# EasyEDA Pro project uven2-mk3-cc-driver-80x.eprj, schematic Schematic1
Board Name: Board1; Create Date: 2025-05-28; Page Name: P1; Project Name: uven2-mk3-cc-driver-80x; Schematic Name: Schematic1; Update Date: 2025-05-28; Company: EasyEDA.com; Page Size: A4; Version: V1.0
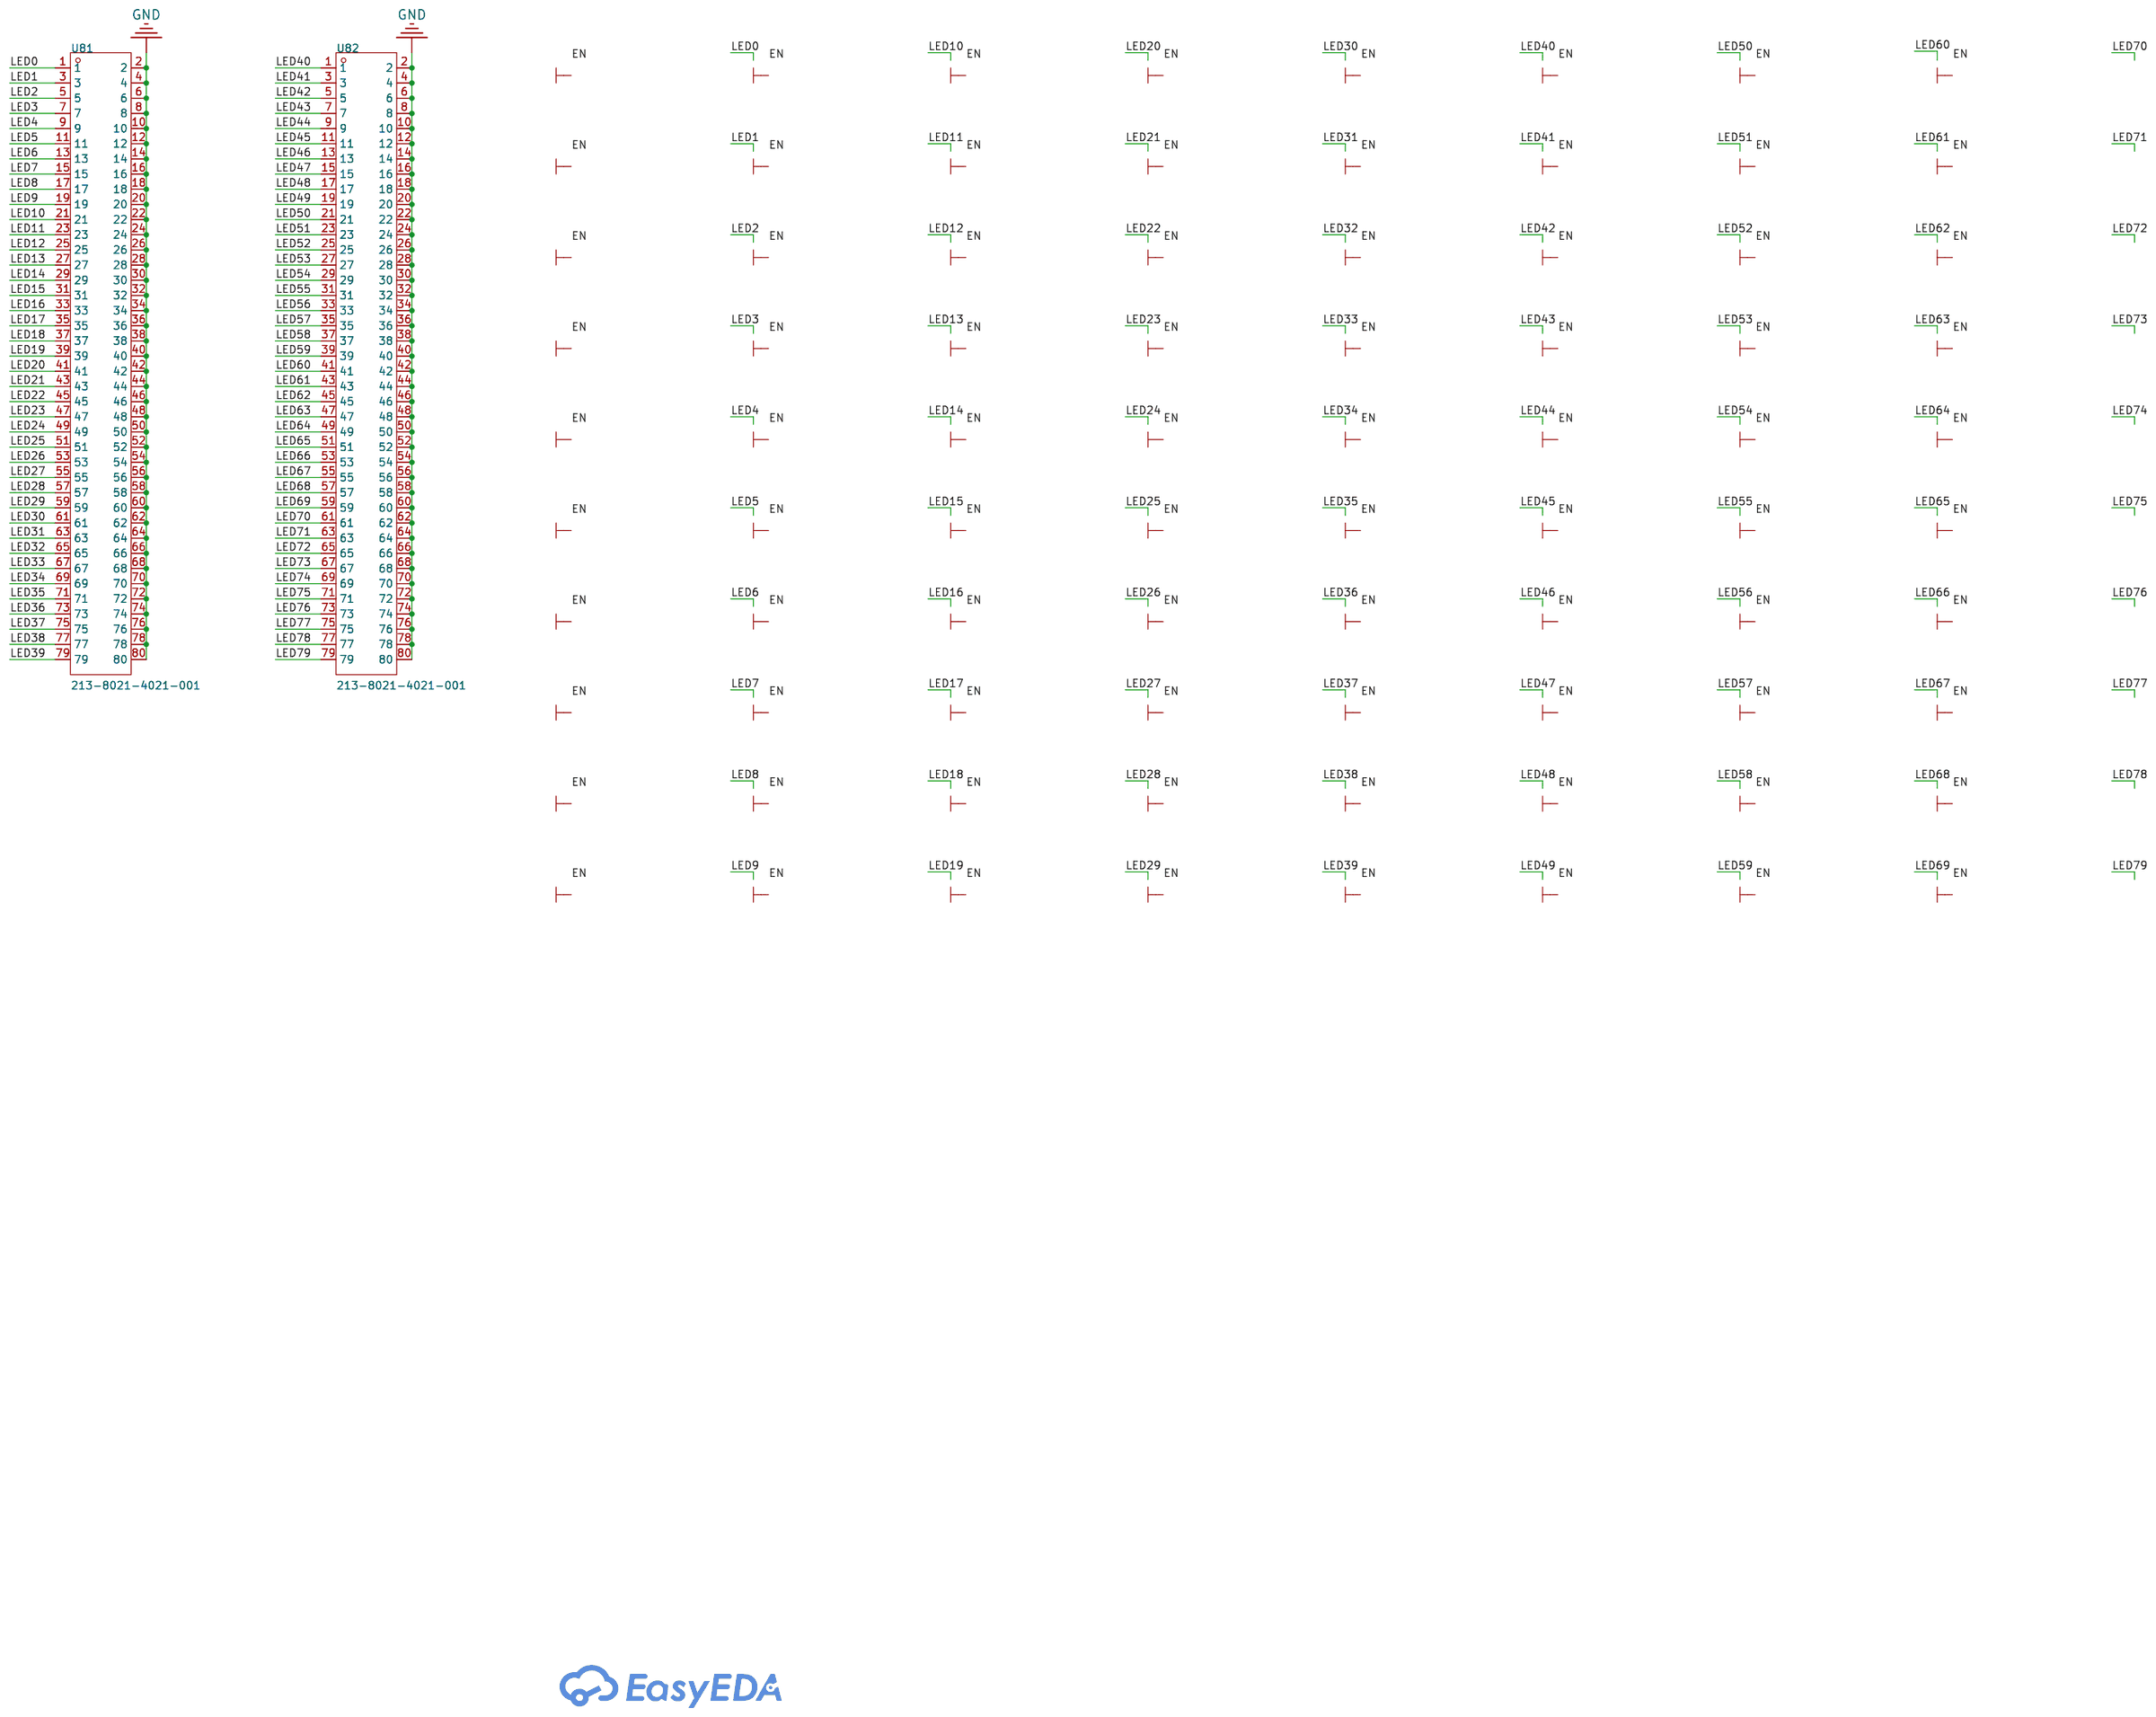
[diagram p0: schematic sheet]

## Parts
CBB1  -
CBB2  -
CBB3  -
CBB4  -
CBB5  -
CBB6  -
CBB7  -
CBB8  -
CBB9  -
CBB10  -
CBB11  -
CBB12  -
CBB13  -
CBB14  -
CBB15  -
CBB16  -
CBB17  -
CBB18  -
CBB19  -
CBB20  -
CBB21  -
CBB22  -
CBB23  -
CBB24  -
CBB25  -
CBB26  -
CBB27  -
CBB28  -
CBB29  -
CBB30  -
CBB31  -
CBB32  -
CBB33  -
CBB34  -
CBB35  -
CBB36  -
CBB37  -
CBB38  -
CBB39  -
CBB40  -
CBB41  -
CBB42  -
CBB43  -
CBB44  -
CBB45  -
CBB46  -
CBB47  -
CBB48  -
CBB49  -
CBB50  -
CBB51  -
CBB52  -
CBB53  -
CBB54  -
CBB55  -
CBB56  -
CBB57  -
CBB58  -
CBB59  -
CBB60  -
CBB61  -
CBB62  -
CBB63  -
CBB64  -
CBB65  -
CBB66  -
CBB67  -
CBB68  -
CBB69  -
CBB70  -
CBB71  -
CBB72  -
CBB73  -
CBB74  -
CBB75  -
CBB76  -
CBB77  -
CBB78  -
CBB79  -
CBB80  -
U81  213-8021-4021-001  [HDR-TH_80P-P2.54-H-M-R2-C40-S2.54-W13.5-N]
U82  213-8021-4021-001  [HDR-TH_80P-P2.54-H-M-R2-C40-S2.54-W13.5-N]

## Library data of the parts
U81 U82 = 213-8021-4021-001: LCSC Part Name: 2x40P 间距:2.54mm 方针 弯插; Supplier Part: C2846095; Manufacturer: Nextron(正凌); Supplier Footprint: 弯插,P=2.54mm; JLCPCB Part Class: Extended Part; Datasheet: https://atta.szlcsc.com/upload/public/pdf/source/20241106/B3AA44D43FCA82CBDD5EE1450DF726D5.pdf; Supplier: LCSC; Pin Structure: 2x40P; Pitch: 2.54mm; Row Spacing: 2.54mm; Circluar Pins/Square Pins: Policy; Mounting Type: Right-Angle; Number of Rows: Double Row; Number of Pins: 80P; Current Rating: 3A; Voltage Rating (Max): 250V; Insulation Height: 2.5mm; Operating Temperature: -25℃~+105℃; Color: Black

## Nets
+12V: CBB1.(ANODE) CBB2.(ANODE) CBB3.(ANODE) CBB4.(ANODE) CBB5.(ANODE) CBB6.(ANODE) CBB7.(ANODE) CBB8.(ANODE) CBB9.(ANODE) CBB10.(ANODE) CBB11.(ANODE) CBB12.(ANODE) CBB13.(ANODE) CBB14.(ANODE) CBB15.(ANODE) CBB16.(ANODE) CBB17.(ANODE) CBB18.(ANODE) CBB19.(ANODE) CBB20.(ANODE) CBB21.(ANODE) CBB22.(ANODE) CBB23.(ANODE) CBB24.(ANODE) CBB25.(ANODE) CBB26.(ANODE) CBB27.(ANODE) CBB28.(ANODE) CBB29.(ANODE) CBB30.(ANODE) CBB31.(ANODE) CBB32.(ANODE) CBB33.(ANODE) CBB34.(ANODE) CBB35.(ANODE) CBB36.(ANODE) CBB37.(ANODE) CBB38.(ANODE) CBB39.(ANODE) CBB40.(ANODE) CBB41.(ANODE) CBB42.(ANODE) CBB43.(ANODE) CBB44.(ANODE) CBB45.(ANODE) CBB46.(ANODE) CBB47.(ANODE) CBB48.(ANODE) CBB49.(ANODE) CBB50.(ANODE) CBB51.(ANODE) CBB52.(ANODE) CBB53.(ANODE) CBB54.(ANODE) CBB55.(ANODE) CBB56.(ANODE) CBB57.(ANODE) CBB58.(ANODE) CBB59.(ANODE) CBB60.(ANODE) CBB61.(ANODE) CBB62.(ANODE) CBB63.(ANODE) CBB64.(ANODE) CBB65.(ANODE) CBB66.(ANODE) CBB67.(ANODE) CBB68.(ANODE) CBB69.(ANODE) CBB70.(ANODE) CBB71.(ANODE) CBB72.(ANODE) CBB73.(ANODE) CBB74.(ANODE) CBB75.(ANODE) CBB76.(ANODE) CBB77.(ANODE) CBB78.(ANODE) CBB79.(ANODE) CBB80.(ANODE) U81.1 U81.3 U81.5 U81.7 U81.9 U81.11 U81.13 U81.15 U81.17 U81.19 U81.21 U81.23 U81.25 U81.27 U81.29 U81.31 U81.33 U81.35 U81.37 U81.39 U81.41 U81.43 U81.45 U81.47 U81.49 U81.51 U81.53 U81.55 U81.57 U81.59 U81.61 U81.63 U81.65 U81.67 U81.69 U81.71 U81.73 U81.75 U81.77 U81.79 U82.1 U82.3 U82.5 U82.7 U82.9 U82.11 U82.13 U82.15 U82.17 U82.19 U82.21 U82.23 U82.25 U82.27 U82.29 U82.31 U82.33 U82.35 U82.37 U82.39 U82.41 U82.43 U82.45 U82.47 U82.49 U82.51 U82.53 U82.55 U82.57 U82.59 U82.61 U82.63 U82.65 U82.67 U82.69 U82.71 U82.73 U82.75 U82.77 U82.79
GND: U81.2 U81.4 U81.6 U81.8 U81.10 U81.12 U81.14 U81.16 U81.18 U81.20 U81.22 U81.24 U81.26 U81.28 U81.30 U81.32 U81.34 U81.36 U81.38 U81.40 U81.42 U81.44 U81.46 U81.48 U81.50 U81.52 U81.54 U81.56 U81.58 U81.60 U81.62 U81.64 U81.66 U81.68 U81.70 U81.72 U81.74 U81.76 U81.78 U81.80 U82.2 U82.4 U82.6 U82.8 U82.10 U82.12 U82.14 U82.16 U82.18 U82.20 U82.22 U82.24 U82.26 U82.28 U82.30 U82.32 U82.34 U82.36 U82.38 U82.40 U82.42 U82.44 U82.46 U82.48 U82.50 U82.52 U82.54 U82.56 U82.58 U82.60 U82.62 U82.64 U82.66 U82.68 U82.70 U82.72 U82.74 U82.76 U82.78 U82.80
